# Altium schematic sheet USB_OTG_HS.SchDoc: USB OTG HS PHY with Micro A-B connector
size A4; Date: 25-FEB-2015; Author: A.B; CompanyName: STMicroelectronics; Address1: 12, Rue Jules HOROWITZ; Address2: 38019 Grenoble; Address3: FRANCE; DocumentNumber: MB1191; Revision: B-02; SheetNumber: 11; SheetTotal: 14; Project: STM32F746G-DISCO
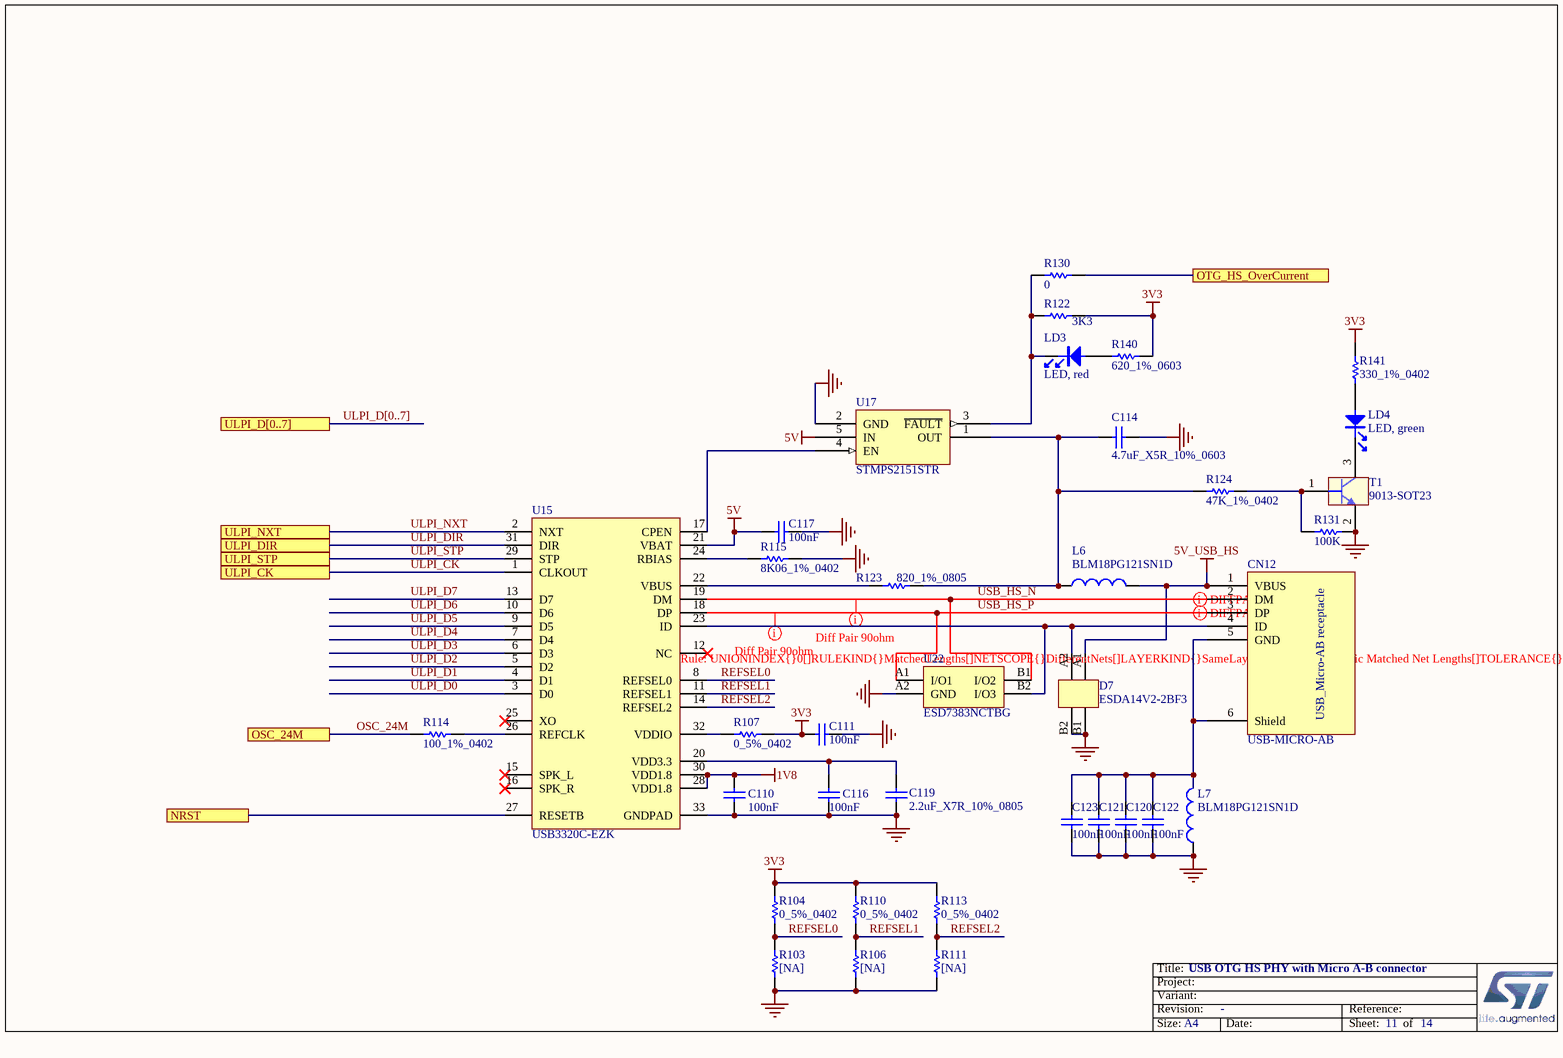
[diagram p0: USB_OTG_HS.SchDoc]

## Parts
C110  100nF  [0402C]
C111  100nF  [0402C]
C114  4.7uF_X5R_10%_0603  [0603C]
C116  100nF  [0402C]
C117  100nF  [0402C]
C119  2.2uF_X7R_10%_0805  [0805C]
C120  100nF  [0402C]
C121  100nF  [0402C]
C122  100nF  [0402C]
C123  100nF  [0402C]
CN12  USB-MICRO-AB  [USB-MICRO-AB]
D7  ESDA14V2-2BF3  [BGA4_1X1]
L6  BLM18PG121SN1D  [0603L]
L7  BLM18PG121SN1D  [0603L]
LD3  LED, red  [0603D]
LD4  LED, green  [0603D]
R103  [NA]  [0402R]
R104  0_5%_0402  [0402R]
R106  [NA]  [0402R]
R107  0_5%_0402  [0402R]
R110  0_5%_0402  [0402R]
R111  [NA]  [0402R]
R113  0_5%_0402  [0402R]
R114  100_1%_0402  [0402R]
R115  8K06_1%_0402  [0402R]
R122  3K3  [0402R]
R123  820_1%_0805  [0805R]
R124  47K_1%_0402  [0402R]
R130  0  [0402R]
R131  100K  [0402R]
R140  620_1%_0603  [0603R]
R141  330_1%_0402  [0402R]
T1  9013-SOT23  [SOT23]
U15  USB3320C-EZK  [QFN32_0R5_5X5]
U17  STMPS2151STR  [SOT23-5L]
U22  ESD7383NCTBG  [ESD_WLCSP4_CASE-567CB_0P80X0P80_P040]

## Ports
NRST, OSC_24M, OTG_HS_OverCurrent, ULPI_CK, ULPI_D[0..7], ULPI_DIR, ULPI_NXT, ULPI_STP

## Nets
1V8: C110.2 U15.28(VDD1.8) U15.30(VDD1.8)
3V3: C111.1 R104.2 R107.2 R110.2 R113.2 R122.1 R140.2 R141.2
5V: C117.1 U15.21(VBAT) U17.5(IN)
5V_USB_HS: CN12.1(VBUS) D7.A1 L6.2
GND: C110.1 C111.2 C114.2 C116.1 C117.2 C119.1 C120.1 C121.1 C122.1 C123.1 D7.B1 D7.B2 L7.1 R103.1 R106.1 R111.1 R115.2 R131.2 T1.2(E) U15.33(GNDPAD) U17.2(GND) U22.A2(GND)
NRST: U15.27(RESETB) ; port NRST
OSC_24M: R114.1 ; port OSC_24M
OTG_HS_OverCurrent: R130.2 ; port OTG_HS_OverCurrent
REFSEL0: R103.2 R104.1 U15.8(REFSEL0)
REFSEL1: R106.2 R110.1 U15.11(REFSEL1)
REFSEL2: R111.2 R113.1 U15.14(REFSEL2)
ULPI_CK: U15.1(CLKOUT) ; port ULPI_CK
ULPI_D0: U15.3(D0)
ULPI_D1: U15.4(D1)
ULPI_D2: U15.5(D2)
ULPI_D3: U15.6(D3)
ULPI_D4: U15.7(D4)
ULPI_D5: U15.9(D5)
ULPI_D6: U15.10(D6)
ULPI_D7: U15.13(D7)
ULPI_DIR: U15.31(DIR) ; port ULPI_DIR
ULPI_NXT: U15.2(NXT) ; port ULPI_NXT
ULPI_STP: U15.29(STP) ; port ULPI_STP
USB_HS_N: CN12.2(DM) U15.19(DM) U22.B1(I/O2)
USB_HS_P: CN12.3(DP) U15.18(DP) U22.A1(I/O1)
NetC114_1: C114.1 L6.1 R123.2 R124.1 U17.1(OUT)
NetC116_2: C116.2 C119.2 U15.20(VDD3.3)
NetC120_2: C120.2 C121.2 C122.2 C123.2 CN12.5(GND) CN12.6(Shield) L7.2
NetCN12_4: CN12.4(ID) D7.A2 U15.23(ID) U22.B2(I/O3)
NetLD3_1: LD3.1 R140.1
NetLD3_2: LD3.2 R122.2 R130.1 U17.3(~{FAULT})
NetLD4_1: LD4.1 R141.1
NetLD4_2: LD4.2 T1.3(C)
NetR107_1: R107.1 U15.32(VDDIO)
NetR114_2: R114.2 U15.26(REFCLK)
NetR115_1: R115.1 U15.24(RBIAS)
NetR123_1: R123.1 U15.22(VBUS)
NetR124_2: R124.2 R131.1 T1.1(B)
NetU15_17: U15.17(CPEN) U17.4(EN)

Not connected (* = marked no-connect by the designer): U15 12(NC)* 15(SPK_L)* 16(SPK_R)* 25(XO)*

## Buses and harness runs
bus ULPI_D[0..7] = port ULPI_D[0..7]

## Layout directives
differential pair: USB_HS_N, USB_HS_P
rule Matched Net Lengths [Tolerance = 150mil]: USB_HS_N, USB_HS_P

## Notes on the sheet
- Title:
- Project:
- Size:
- Revision:
- Variant:
- A4
- -
- Date:
- Reference:
- Sheet:
- of
- (in symbol USB-MICRO-AB) USB_Micro-AB receptacle

## Library data of the parts
C110 C111 C116 C117 C120-C123 = Cap_100nF_X7R_10%_0402: Capacitor,100nF,16V,X7R,10%,0402,YAGEO; Manuf_Part_1: CC0402KRX7R7BB104; Revision: July-2002: Re-released for DXP Platform.; Value: 100nF; Order: CC0402KRX7R7BB104; Manuf_1: YAGEO
C114 = Cap_4.7uF_X5R_10%_0603: Capacitor,4.7uF,16V, X5R,10%,0603,YAGEO; Manuf_Part_1: CC0603KRX5R7BB475; Order: CC0603KRX5R7BB105; Revision: July-2002: Re-released for DXP Platform.; Value: 4.7uF; Manuf_1: YAGEO; ECCN_US/EU: n/a
C119 = Cap_2.2uF_X7R_10%_0805: Capacitor,2.2uF,16V, X7R,10%,0805,YAGEO; Manuf_Part_1: CC0805KKX7R7BB225; Revision: July-2002: Re-released for DXP Platform.; Value: 2.2uF; Order: CC0805KKX7R7BB225; Manuf_1: YAGEO; ECCN_US/EU: n/a
CN12 = USB-MICRO-AB: USB-MICRO-AB, 47590-0001, SMT, MOLEX; Ref St: xxxxxxx; Manuf_1: MOLEX; Manuf_Part_1: 47590-0001; ECCN_US/EU: n/a; Distrib: *
D7 = ESDA14V2-2BF3: Quad bidirectional Transil array for ESD protection; Manuf_1: STM; ECCN_US/EU: EAR99/NEC; Provided: ST; Ref St: 9179040; Distrib: ST; Manuf_Part_1: ESDA14V2-2BF3
L6 L7 = BEAD_120R_2A_0603: Bead,120R,2A,0603,BLM18PG121SN1D,MURATA; Manuf_Part_3: FCM1608KF-601T03; Manuf_2: TDK; Manuf_Part_2: MPZ1608S300A; Manuf_3: Tai-tech; Value: 100uH; Description_3: Bead,600R,350mA,0603,FCM1608KF-601T03,Tai-tech; Description_2: Bead,30R,5A,0603,MPZ1608S300A,TDK; Revision: July-2002: Re-released for DXP Platform.; ECCN_US/EU: n/a; Manuf_Part_1: BLM18PG121SN1D; Manuf_1: MURATA
LD3 = LED_red: LED, red, 0603; Manuf_1: everlight; Manuf_Part_1: 19-217/R6C-AL1M2VY/3T; ECCN_US/EU: EAR99/NEC; Order: 19-217/R6C-AL1M2VY/3T
LD4 = LED_green: LED, green, 0603; Manuf_1: everlight; Manuf_Part_1: 19-213SYGC/S530-E2/TR8; ECCN_US/EU: EAR99/NEC; Order: 19-213SYGC/S530-E2/TR8
R103 R106 R111 = Res_NA_0402: Resistor,[NA],0402; Fitted: NO; Value: [NA]; ECCN_US/EU: n/a
R104 R107 R110 R113 = Res_0_5%_0402: Resistor,0,0402,5%,YAGEO; Manuf_Part_1: RC0402JR-070RL; Value: 0; Order: 2363467; ECCN_US/EU: n/a; Manuf_1: YAGEO; Distrib: FARNELL
R114 = Res_100_1%_0402: Resistor,100,0402,1%,YAGEO; Manuf_Part_1: RC0402FR-07100RL; Value: 100; Order: 9239111; Manuf_1: YAGEO; ECCN_US/EU: n/a; Distrib: FARNELL
R115 = Res_8K06_1%_0402: Resistor,8K06,0402,1%,YAGEO; Manuf_Part_1: RC0402FR-078K06L; Value: 8K06; Manuf_1: YAGEO; Order: RC0402FR-078K06L; ECCN_US/EU: n/a; Distrib: DIGIKEY
R122 = Res_3K3_1%_0402: Resistor,3K3,0402,1%,YAGEO; Manuf_Part_1: RC0402FR-073K3L; Value: 3K3; Manuf_1: YAGEO; Order: *; ECCN_US/EU: n/a; Distrib: FARNELL
R123 = Res_820_1%_0805: Resistor,820,0805,1%,YAGEO; Manuf_Part_1: RC0805FR-07820RL; Value: 820; Manuf_1: YAGEO; Order: RC0805FR-07820RL; ECCN_US/EU: n/a
R124 = Res_47K_1%_0402: Resistor,47K,0402,1%,YAGEO; Manuf_Part_1: RC0402FR-0747KL; Order: 9239430; Value: 47K; Manuf_1: YAGEO; ECCN_US/EU: n/a; Distrib: FARNELL
R130 = Res_0_5%_0402: Resistor,0,0402,5%,YAGEO; Manuf_Part_1: RC0402JR-070RL; Order: 2363467; Value: 0; ECCN_US/EU: n/a; Manuf_1: YAGEO; Distrib: FARNELL
R131 = Res_100K_1%_0402: Resistor,100K,0402,1%,YAGEO; Manuf_Part_1: RT0402FRE07100KL; Value: 100K; Manuf_1: YAGEO; Order: RT0402FRE07100KL; ECCN_US/EU: n/a
R140 = Res_620_1%_0603: Resistor,620,0603,1%,VISHAY; Manuf_Part_1: CRCW0603620RFKEA; Manuf_1: VISHAY DRALORIC; Value: 620; Order: 2122341; ECCN_US/EU: n/a; Distrib: FARNELL
R141 = Res_330_1%_0402: Resistor,330,0402,1%,YAGEO; Manuf_Part_1: RC0402FR-07330RL; Value: 330; ECCN_US/EU: n/a; Manuf_1: YAGEO; Distrib: DIGIKEY; Order: RC0402FR-07330RL
T1 = 9013-SOT23: NPN Bipolar Transistor; Manuf_1: NXP; Manuf_Part_1: BSR14; Order: 1081310; ECCN_US/EU: EAR99/NEC; Revision: July-2002: Re-released for DXP Platform.; Distrib: FARNELL
U15 = USB3320C-EZK: USB3320C,  Hi-Speed USB Host, Device or OTG PHY with ULPI Low Pin Interface; Manuf_1: MICROCHIP; Manuf_Part_1: USB3320C-EZK-TR; Distrib: MICROCHIP; Order: USB3320C-EZK-TR; ECCN_US/EU: *
U17 = STMPS2151STR: Enhanced single channel power switches; Manuf_1: STM; Provided: ST; ECCN_US/EU: EAR99/NEC; Ref St: xxxxxx; Order: STMPS2151STR; Manuf_Part_1: STMPS2151STR; Distrib: ST
U22 = ESD7383NCTBG: 3-line low capacitance protection for high speed USB; Manuf_1: ON SEMICONDUCTOR; ECCN_US/EU: EAR99/NEC; provided: SUBCO; Manuf_Part_1: ESD7383NCTBG; value: ESD7383NCTBG